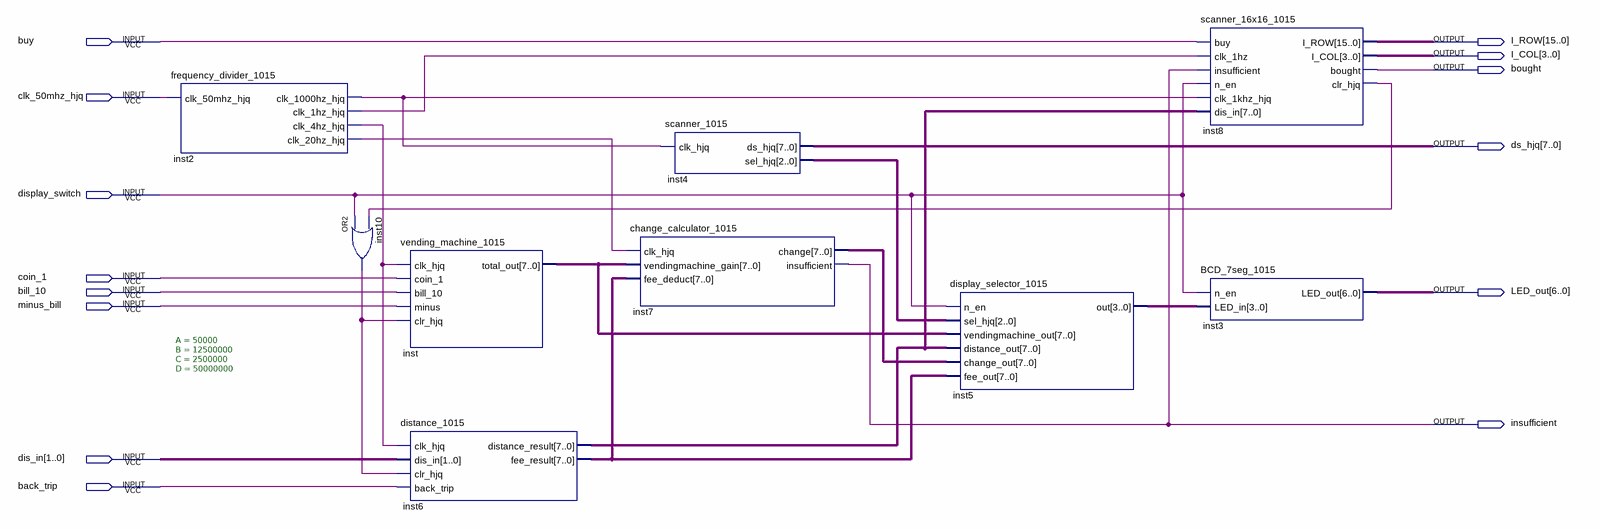
[diagram p0: schematic sheet]
// Quartus schematic top_1015.bdf as structural Verilog: 9 symbols, 14 pins
module top_1015 (
  input  buy,
  input  clk_50mhz_hjq,
  input  display_switch,
  input  coin_1,
  input  bill_10,
  input  minus_bill,
  input  [1:0] dis_in,
  input  back_trip,
  output [15:0] I_ROW,
  output [3:0] I_COL,
  output bought,
  output [7:0] ds_hjq,
  output [6:0] LED_out,
  output insufficient
);

  wire inst2_clk_1hz_hjq, inst2_clk_4hz_hjq, inst2_clk_20hz_hjq, inst2_clk_1000hz_hjq, inst8_clr_hjq,
       inst10_out;
  wire [2:0] inst4_sel_hjq;
  wire [3:0] inst5_out;
  wire [7:0] inst6_distance_result, inst6_fee_result, inst7_change, inst_total_out;

  frequency_divider_1015 #(.A(50000), .B(12500000), .C(2500000), .D(50000000)) inst2 (
    .clk_50mhz_hjq(clk_50mhz_hjq), .clk_1000hz_hjq(inst2_clk_1000hz_hjq), .clk_1hz_hjq(inst2_clk_1hz_hjq),
    .clk_4hz_hjq(inst2_clk_4hz_hjq), .clk_20hz_hjq(inst2_clk_20hz_hjq));
  or inst10 (inst10_out, display_switch, inst8_clr_hjq);
  vending_machine_1015 inst (
    .clk_hjq(inst2_clk_4hz_hjq), .coin_1(coin_1), .bill_10(bill_10), .minus(minus_bill),
    .clr_hjq(inst10_out), .total_out(inst_total_out));
  distance_1015 inst6 (
    .clk_hjq(inst2_clk_4hz_hjq), .dis_in(dis_in), .clr_hjq(inst10_out), .back_trip(back_trip),
    .distance_result(inst6_distance_result), .fee_result(inst6_fee_result));
  change_calculator_1015 inst7 (
    .clk_hjq(inst2_clk_20hz_hjq), .vendingmachine_gain(inst_total_out), .fee_deduct(inst6_fee_result),
    .change(inst7_change), .insufficient(insufficient));
  scanner_1015 inst4 (.clk_hjq(inst2_clk_1000hz_hjq), .ds_hjq(ds_hjq), .sel_hjq(inst4_sel_hjq));
  display_selector_1015 inst5 (
    .n_en(display_switch), .sel_hjq(inst4_sel_hjq), .vendingmachine_out(inst_total_out),
    .distance_out(inst6_distance_result), .change_out(inst7_change), .fee_out(inst6_fee_result),
    .out(inst5_out));
  scanner_16x16_1015 inst8 (
    .buy(buy), .clk_1hz(inst2_clk_1hz_hjq), .insufficient(insufficient), .n_en(display_switch),
    .clk_1khz_hjq(inst2_clk_1000hz_hjq), .dis_in(inst6_distance_result), .I_ROW(I_ROW), .I_COL(I_COL),
    .bought(bought), .clr_hjq(inst8_clr_hjq));
  BCD_7seg_1015 inst3 (.n_en(display_switch), .LED_in(inst5_out), .LED_out(LED_out));
endmodule
